# Altium schematic sheet connections_to_beaglebone.SchDoc: Connections to Beagle Bone and XBEE
size A; DrawnBy: Mike Mozingo; Engineer: Mike Mozingo; Revision: 1; ProjectName: eyeCU
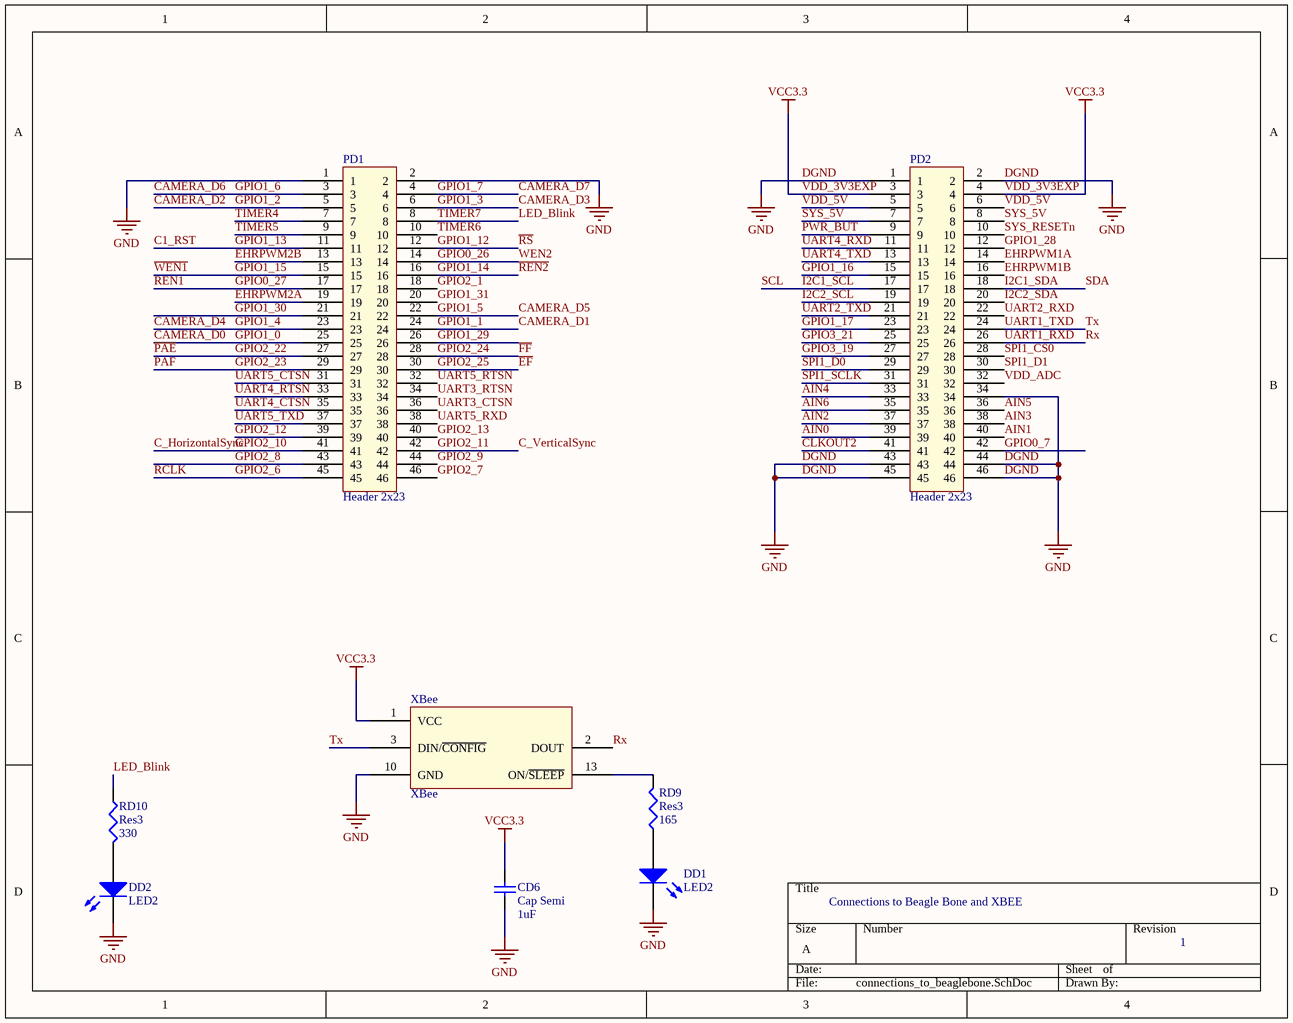
[diagram p0: connections_to_beaglebone.SchDoc]

## Parts
CD6  Cap Semi  value 1uF  [CAPC1608L]
DD1  LED2  [DIODE1608]
DD2  LED2  [DIODE1608]
PD1  Header 2x23  [HDR2X23]
PD2  Header 2x23  [HDR2X23]
RD9  Res3  value 165  [RESC1608L]
RD10  Res3  value 330  [RESC1608L]
XBee  XBee  [XBee]

## Nets
DGND: CD6.1 DD1.2(K) DD2.2(K) PD1.1 PD1.2 PD2.1 PD2.2 PD2.34 PD2.43 PD2.44 PD2.45 PD2.46 XBee.10(GND)  [also labelled GND]
VDD_3V3EXP: CD6.2 PD2.3 PD2.4 XBee.1(VCC)  [also labelled VCC3.3]
~{REN1}: PD1.17  [also labelled GPIO0_27]
~{REN2}: PD1.16  [also labelled GPIO1_14]
~{RS}: PD1.12  [also labelled GPIO1_12]
~{WEN1}: PD1.15  [also labelled GPIO1_15]
AIN0: PD2.39
AIN1: PD2.40
AIN2: PD2.37
AIN3: PD2.38
AIN4: PD2.33
AIN5: PD2.36
AIN6: PD2.35
C1_RST: PD1.11  [also labelled GPIO1_13]
C_HorizontalSync: PD1.41  [also labelled GPIO2_10]
C_VerticalSync: PD1.42  [also labelled GPIO2_11]
CAMERA_D0: PD1.25  [also labelled GPIO1_0]
CAMERA_D1: PD1.24  [also labelled GPIO1_1]
CAMERA_D2: PD1.5  [also labelled GPIO1_2]
CAMERA_D3: PD1.6  [also labelled GPIO1_3]
CAMERA_D4: PD1.23  [also labelled GPIO1_4]
CAMERA_D5: PD1.22  [also labelled GPIO1_5]
CAMERA_D6: PD1.3  [also labelled GPIO1_6]
CAMERA_D7: PD1.4  [also labelled GPIO1_7]
CLKOUT2: PD2.41
~{EF}: PD1.30  [also labelled GPIO2_25]
EHRPWM1A: PD2.14
EHRPWM1B: PD2.16
EHRPWM2A: PD1.19
EHRPWM2B: PD1.13
~{FF}: PD1.28  [also labelled GPIO2_24]
GPIO0_7: PD2.42
GPIO0_26: PD1.14  [also labelled WEN2]
GPIO1_16: PD2.15
GPIO1_17: PD2.23
GPIO1_28: PD2.12
GPIO1_29: PD1.26
GPIO1_30: PD1.21
GPIO1_31: PD1.20
GPIO2_1: PD1.18
GPIO2_6: PD1.45  [also labelled RCLK]
GPIO2_7: PD1.46
GPIO2_8: PD1.43
GPIO2_9: PD1.44
GPIO2_12: PD1.39
GPIO2_13: PD1.40
GPIO2_22: PD1.27  [also labelled ~{PAE}]
GPIO2_23: PD1.29  [also labelled ~{PAF}]
GPIO3_19: PD2.27
GPIO3_21: PD2.25
I2C1_SCL: PD2.17  [also labelled SCL]
I2C1_SDA: PD2.18  [also labelled SDA]
I2C2_SCL: PD2.19
I2C2_SDA: PD2.20
LED_Blink: PD1.8 RD10.2  [also labelled TIMER7]
PWR_BUT: PD2.9
Rx: PD2.26 XBee.2(DOUT)  [also labelled UART1_RXD]
SPI1_CS0: PD2.28
SPI1_D0: PD2.29
SPI1_D1: PD2.30
SPI1_SCLK: PD2.31
SYS_5V: PD2.7 PD2.8
SYS_RESETn: PD2.10
TIMER4: PD1.7
TIMER5: PD1.9
TIMER6: PD1.10
Tx: PD2.24 XBee.3(DIN/~{CONFIG})  [also labelled UART1_TXD]
UART2_RXD: PD2.22
UART2_TXD: PD2.21
UART3_CTSN: PD1.36
UART3_RTSN: PD1.34
UART4_CTSN: PD1.35
UART4_RTSN: PD1.33
UART4_RXD: PD2.11
UART4_TXD: PD2.13
UART5_CTSN: PD1.31
UART5_RTSN: PD1.32
UART5_RXD: PD1.38
UART5_TXD: PD1.37
VDD_5V: PD2.5 PD2.6
VDD_ADC: PD2.32
NetDD1_1: DD1.1(A) RD9.1
NetDD2_1: DD2.1(A) RD10.1
NetRD9_2: RD9.2 XBee.13(ON/~{SLEEP})

Not connected (* = marked no-connect by the designer): XBee 4(D08) 5(~{RESET}) 6(PWM0/RSSI) 7(PWM1) 8([reserved]) 9(~{DTR}/SLEEP_RQ/DI8) 11(AD4/DIO4) 12(~{CTS}/DIO7) 14(VREF) 15(Associate/AD5/DIO5) 16(~{RTS}/AD6/DIO6) 17(AD3/DIO3) 18(AD2/DIO2) 19(AD1/DIO1) 20(AD0/DIO0)

## Library data of the parts
CD6 = Cap Semi: Capacitor (Semiconductor SIM Model); Published: 8-Jun-2000; LatestRevisionDate: 29-May-2009; LatestRevisionNote: IPC-7351 Footprint Added.; PackageReference: C1206; Publisher: Altium Limited; PackageDescription: Chip Capacitor
DD1 DD2 = LED2: Typical RED, GREEN, YELLOW, AMBER GaAs LED; Published: 8-Jun-2000; LatestRevisionDate: 17-Jul-2002; LatestRevisionNote: Re-released for DXP Platform.; PackageVersion: Feb-2002; PackageReference: 3.2X1.6X1.1; Publisher: Altium Limited
  DD1: Color: Blue
  DD2: Color: Pink
RD9 RD10 = Res3: Resistor; Published: 8-Jun-2000; LatestRevisionDate: 29-May-2009; LatestRevisionNote: IPC-7351 Footprint Added.; PackageReference: J1-0603; Publisher: Altium Limited; PackageDescription: Chip Resistor
XBee = XBee: XBee wireless transmitter/reveiver